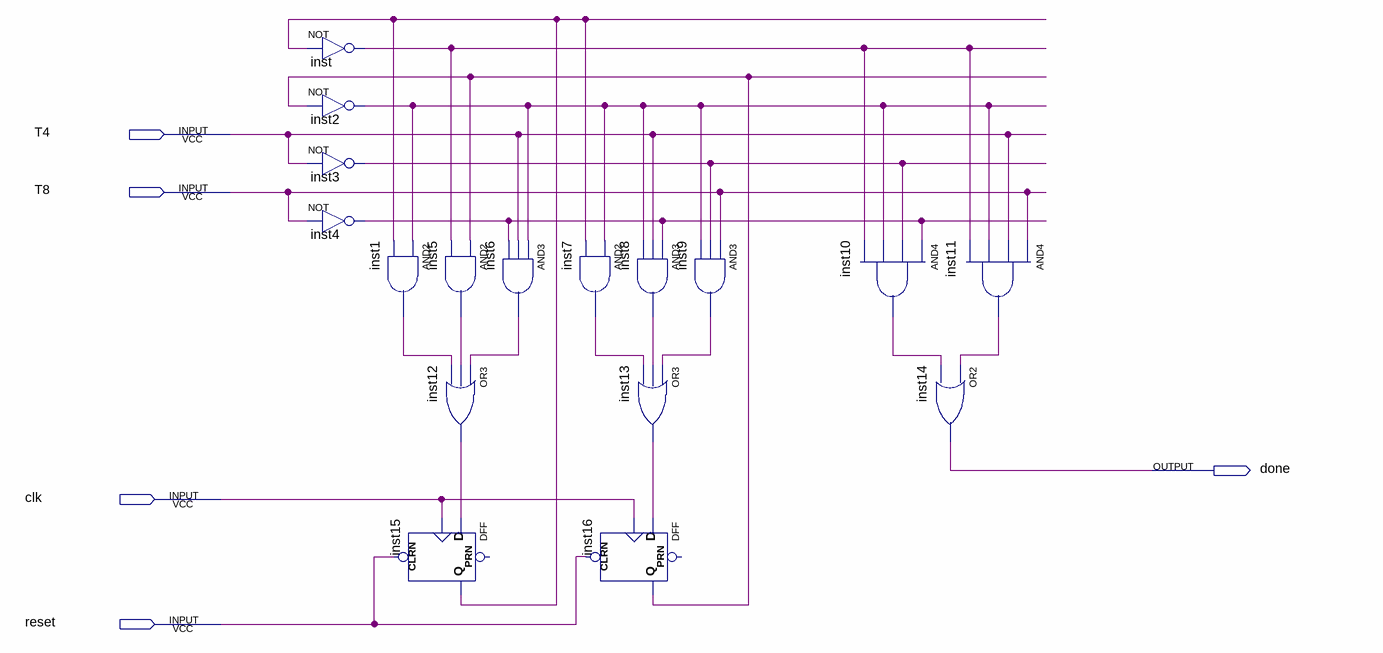
[diagram p0: schematic sheet]
// Quartus schematic T4_8.bdf as structural Verilog: 17 symbols, 5 pins
module T4_8 (
  input  T4,
  input  T8,
  input  clk,
  input  reset,
  output done
);

  wire inst1_out, inst2_out, inst3_out, inst4_out, inst5_out, inst6_out, inst7_out, inst8_out, inst9_out,
       inst10_out, inst11_out, inst12_out, inst13_out, inst15_q, inst16_q, inst_out;

  not inst (inst_out, inst15_q);
  not inst2 (inst2_out, inst16_q);
  not inst3 (inst3_out, T4);
  not inst4 (inst4_out, T8);
  and inst1 (inst1_out, inst2_out, inst15_q);
  and inst5 (inst5_out, inst16_q, inst_out);
  or inst12 (inst12_out, inst6_out, inst5_out, inst1_out);
  DFF inst15 (.CLRN(reset), .CLK(clk), .D(inst12_out), .Q(inst15_q));  // open: PRN
  and inst6 (inst6_out, inst2_out, T4, inst4_out);
  and inst7 (inst7_out, inst2_out, inst15_q);
  DFF inst16 (.CLRN(reset), .CLK(clk), .D(inst13_out), .Q(inst16_q));  // open: PRN
  and inst8 (inst8_out, inst4_out, T4, inst2_out);
  and inst9 (inst9_out, T8, inst3_out, inst2_out);
  or inst13 (inst13_out, inst9_out, inst8_out, inst7_out);
  and inst10 (inst10_out, inst4_out, inst3_out, inst2_out, inst_out);
  and inst11 (inst11_out, T8, T4, inst2_out, inst_out);
  or inst14 (done, inst11_out, inst10_out);
endmodule
